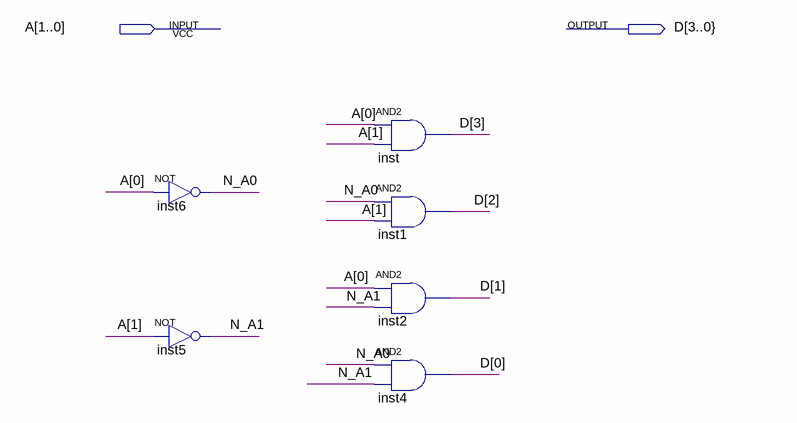
[diagram p0: schematic sheet]
// Quartus schematic decoderAux.bdf as structural Verilog: 6 symbols, 2 pins
module decoderAux (
  input  [1:0] A,
  output \D[3..0} 
);

  wire N_A0, N_A1;
  wire [3:0] D;

  not inst6 (N_A0, A[0]);
  not inst5 (N_A1, A[1]);
  and inst (D[3], A[0], A[1]);
  and inst1 (D[2], N_A0, A[1]);
  and inst2 (D[1], A[0], N_A1);
  and inst4 (D[0], N_A0, N_A1);
endmodule
